# EAGLE schematic dacmo (EAGLE 7.5.0)
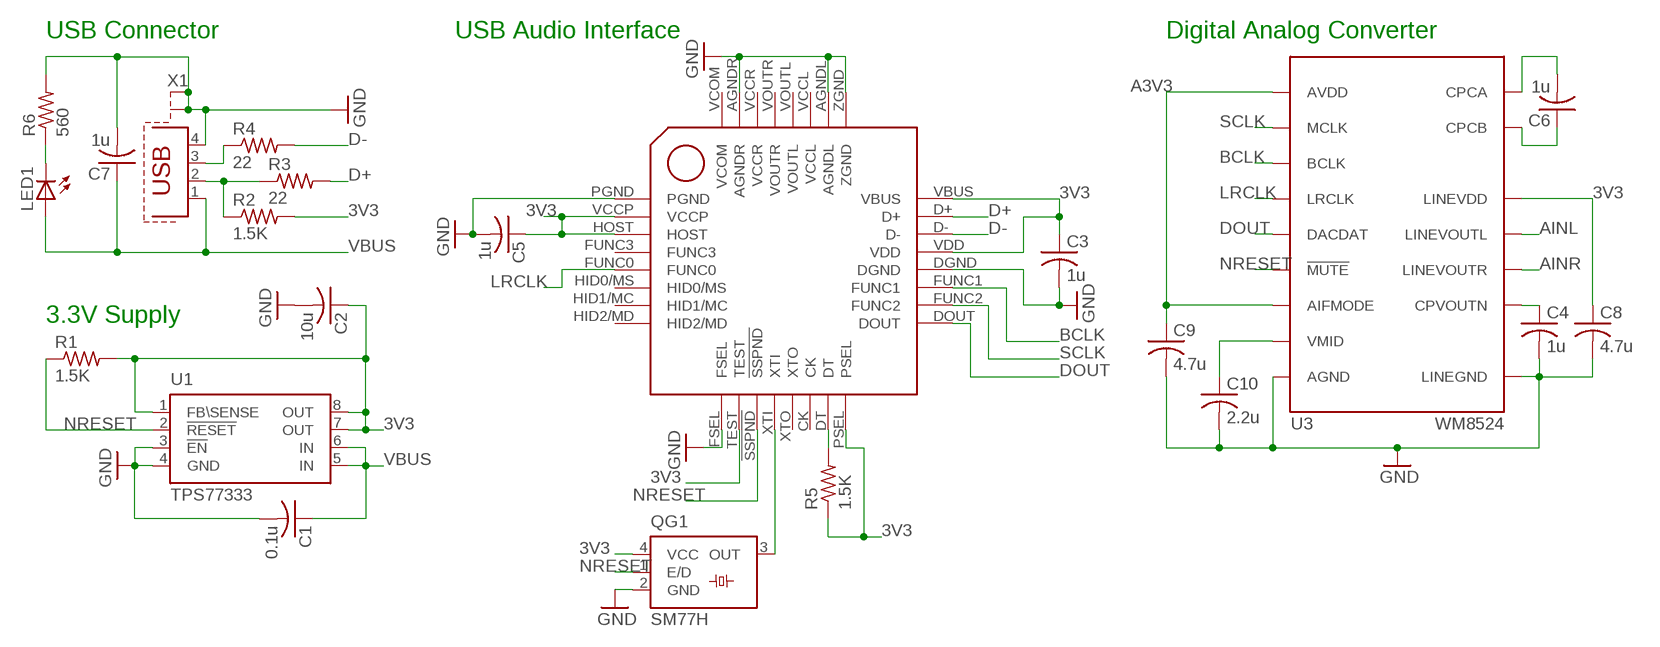
[diagram p0: schematic, sheet 1]

## Parts
C1  0.1u  C-USC0805  [C0805]
C2  10u  C-USC0805  [C0805]
C3  1u  C-USC0805  [C0805]
C4  1u  C-USC0805  [C0805]
C5  1u  C-USC0805  [C0805]
C6  1u  C-USC0805  [C0805]
C7  1u  C-USC0805  [C0805]
C8  4.7u  C-USC0805  [C0805]
C9  4.7u  C-USC0805  [C0805]
C10  2.2u  C-USC0805  [C0805]
LED1  LEDCHIP-LED0805  [CHIP-LED0805]
QG1  SM77H  [SM77H]
R1  1.5K  R-US_R0805  [R0805]
R2  1.5K  R-US_R0805  [R0805]
R3  22  R-US_R0805  [R0805]
R4  22  R-US_R0805  [R0805]
R5  1.5K  R-US_R0805  [R0805]
R6  560  R-US_R0805  [R0805]
U1  TPS77333  [SOP-08]
U2  PCM2706  [TQFP32-08]
U3  WM8524  [SSOP16]
X1  PN61729-S  [PN61729-S]

## Nets
3V3: C2.1 C3.1 C5.1 C8.1 QG1.4(VCC) R1.2 R2.2 R5.1 U1.1(FB\SENSE) U1.7(OUT) U1.8(OUT) U2.HOST U2.PSEL U2.TEST U2.VBUS U2.VCCP U2.VDD U3.6(LINEVDD)
A3V3: C9.1 U3.12(AIFMODE) U3.15(AVDD)
AINL: U3.1(LINEVOUTL)
AINR: U3.16(LINEVOUTR)
BCLK: U2.FUNC1 U3.9(BCLK)
D+: R3.2 U2.D+
D-: R4.2 U2.D-
DOUT: U2.DOUT U3.7(DACDAT)
GND: C1.2 C2.2 C3.2 C4.2 C5.2 C7.2 C8.2 C9.2 C10.2 QG1.2(GND) R6.2 U1.3(!EN) U1.4(GND) U2.AGNDL U2.AGNDR U2.DGND U2.FSEL U2.PGND U2.ZGND U3.4(LINEGND) U3.13(AGND) X1.4 X1.S1 X1.S2
LRCLK: U2.FUNC0 U3.8(LRCLK)
N$1: R5.2 U2.DT
N$2: R2.1 R3.1 X1.2
N$3: R4.1 X1.3
N$4: LED1.C R6.1
N$5: C4.1 U3.2(CPVOUTN)
N$6: C10.1 U3.14(VMID)
N$7: QG1.3(OUT) U2.XTI
N$8: C6.1 U3.3(CPCB)
N$9: C6.2 U3.5(CPCA)
NRESET: QG1.1(E/D) R1.1 U1.2(!RESET) U2.!SSPND U3.11(!MUTE)
SCLK: U2.FUNC2 U3.10(MCLK)
VBUS: C1.1 C7.1 LED1.A U1.5(IN) U1.6(IN) X1.1
Unconnected: U2.CK U2.FUNC3 U2.HID0/MS U2.HID1/MC U2.HID2/MD U2.VOUTL U2.VOUTR U2.XTO

## Notes on the sheet
- USB Connector | USB Audio Interface | Digital Analog Converter
- 3.3V Supply

## Power pins joined to a net without a drawn wire
VCCL: U2.VCCL
VCCR: U2.VCCR
VCOM: U2.VCOM

## Library data of the parts
C1-C10 = rcl:C-US: CAPACITOR, American symbol
LED1 = led:LED: LED OSRAM: - CHIPLED LG R971, LG N971, LY N971, LG Q971, LY Q971, LO R971, LY R971 LH N974, LH R974 LS Q976, LO Q976, LY Q976 LO Q996 - Hyper CHIPLED LW Q18S LB Q993, LB Q99A, LB R99A - SideLED LS A670, LO A670, LY A670, LG A670, LP A670 LB A673, LV A673, LT A673, LW A673 LH A674 LY A675 LS A676, LA A676, LO A676, LY A676, LW A676 LS A679, LY A679, LG A679 - Hyper Micro SIDELED® LS Y876, LA Y876, LO Y876, LY Y876 LT Y87S - SmartLED LW L88C, LW L88S LB L89C, LB L89S, LG L890 LS L89K, LO L89K, LY L89K LS L896, LA L896, LO L896, LY L896 - TOPLED LS T670, LO T670, LY T670, LG T670, LP T670 LSG T670, LSP T670, LSY T670, LOP T670, LYG T670 LG T671, LOG T671, LSG T671 LB T673, LV T673, LT T673, LW T673 LH T674 LS T676, LA T676, LO T676, LY T676, LB T676, LH T676, LSB T676, LW T676 LB T67C, LV T67C, LT T67C, LS T67K, LO T67K, LY T67K, LW E67C LS E67B, LA E67B, LO E67B, LY E67B, LB E67C, LV E67C, LT E67C LW T67C LS T679, LY T679, LG T679 LS T770, LO T770, LY T770, LG T770, LP T770 LB T773, LV T773, LT T773, LW T773 LH T774 LS E675, LA E675, LY E675, LS T675 LS T776, LA T776, LO T776, LY T776, LB T776 LHGB T686 LT T68C, LB T68C - Hyper Mini TOPLED® LB M676 - Mini TOPLED Santana® LG M470 LS M47K, LO M47K, LY M47K Source: http://www.osram.convergy.de LUXEON: - LUMILED® LXK2-PW12-R00, LXK2-PW12-S00, LXK2-PW14-U00, LXK2-PW14-V00 LXK2-PM12-R00, LXK2-PM12-S00, LXK2-PM14-U00 LXK2-PE12-Q00, LXK2-PE12-R00, LXK2-PE12-S00, LXK2-PE14-T00, LXK2-PE14-U00 LXK2-PB12-K00, LXK2-PB12-L00, LXK2-PB12-M00, LXK2-PB14-N00, LXK2-PB14-P00, LXK2-PB14-Q00 LXK2-PR12-L00, LXK2-PR12-M00, LXK2-PR14-Q00, LXK2-PR14-R00 LXK2-PD12-Q00, LXK2-PD12-R00, LXK2-PD12-S00 LXK2-PH12-R00, LXK2-PH12-S00 LXK2-PL12-P00, LXK2-PL12-Q00, LXK2-PL12-R00 Source: www.luxeon.com KINGBRIGHT: KA-3528ASYC Source: www.kingbright.com
QG1 = crystal:SM77H: 3.3V CMOS Clock Oscillator Source: www.pletronics.com .. sm77h%203.3v.pdf; OC_FARNELL: unknown; OC_NEWARK: unknown
R1-R6 = resistor:R-US_: RESISTOR, American symbol
U1 = texas:TPS773*: 250-mA LDO REGULATORS WITH RESET OUTPUT WITH 8-PIN MSOP PACKAGING Source: http://focus.ti.com/lit/ds/symlink/tps77333.pdf; MF: TEXAS INSTRUMENTS; MPN: TPS77333DGK; OC_FARNELL: 1510195; OC_NEWARK: 02M1919
U2 = pcm2706:PCM2706: Texas Instruments' Audio Dac.
U3 = Oles_komponentbibliotek:WM8524: 24-bit 192kHz stereo DAC with 2Vrms ground referenced line output. LJ, RJ, and I2S interface.
X1 = con-berg:PN61729-S: BERG USB connector; OC_FARNELL: unknown; OC_NEWARK: unknown